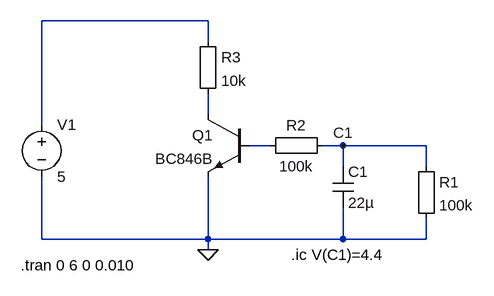
[diagram p0: schematic vypadek-RC.asc]
vypadek-RC.asc, the LTspice schematic file:
Version 4
SHEET 1 880 680
WIRE -48 -144 -304 -144
WIRE -48 -112 -48 -144
WIRE -48 0 -48 -32
WIRE -304 16 -304 -144
WIRE 48 48 16 48
WIRE 160 48 128 48
WIRE 288 48 160 48
WIRE 160 80 160 48
WIRE 288 80 288 48
WIRE -304 192 -304 96
WIRE -48 192 -48 96
WIRE -48 192 -304 192
WIRE 160 192 160 144
WIRE 160 192 -48 192
WIRE 288 192 288 160
WIRE 288 192 160 192
WIRE -48 208 -48 192
FLAG -48 208 0
FLAG 160 48 C1
SYMBOL cap 144 80 R0
SYMATTR InstName C1
SYMATTR Value 22µ
SYMBOL Misc\EuropeanResistor 272 64 R0
SYMATTR InstName R1
SYMATTR Value 100k
SYMBOL Misc\EuropeanResistor 144 32 R90
WINDOW 0 0 56 VBottom 2
WINDOW 3 32 56 VTop 2
SYMATTR InstName R2
SYMATTR Value 100k
SYMBOL npn 16 0 M0
SYMATTR InstName Q1
SYMATTR Value BC846B
SYMBOL Misc\EuropeanResistor -64 -128 R0
SYMATTR InstName R3
SYMATTR Value 10k
SYMBOL voltage -304 0 R0
WINDOW 123 0 0 Left 0
WINDOW 39 0 0 Left 0
SYMATTR InstName V1
SYMATTR Value 5
TEXT -336 232 Left 2 !.tran 0 6 0 0.010
TEXT 80 216 Left 2 !.ic V(C1)=4.4

The netlist it stands for:
* vypadek-RC.asc
C1 C1 0 22µ
R1 C1 0 100k
R2 C1 N003 100k
Q1 N002 N003 0 0 BC846B
R3 N001 N002 10k
V1 N001 0 5
.model NPN NPN
.model PNP PNP
.lib standard.bjt
.tran 0 6 0 0.010
.ic V(C1)=4.4
.backanno
.end